# EAGLE design STELLA (EAGLE 9.6.2)

## Sheet 1 of 2
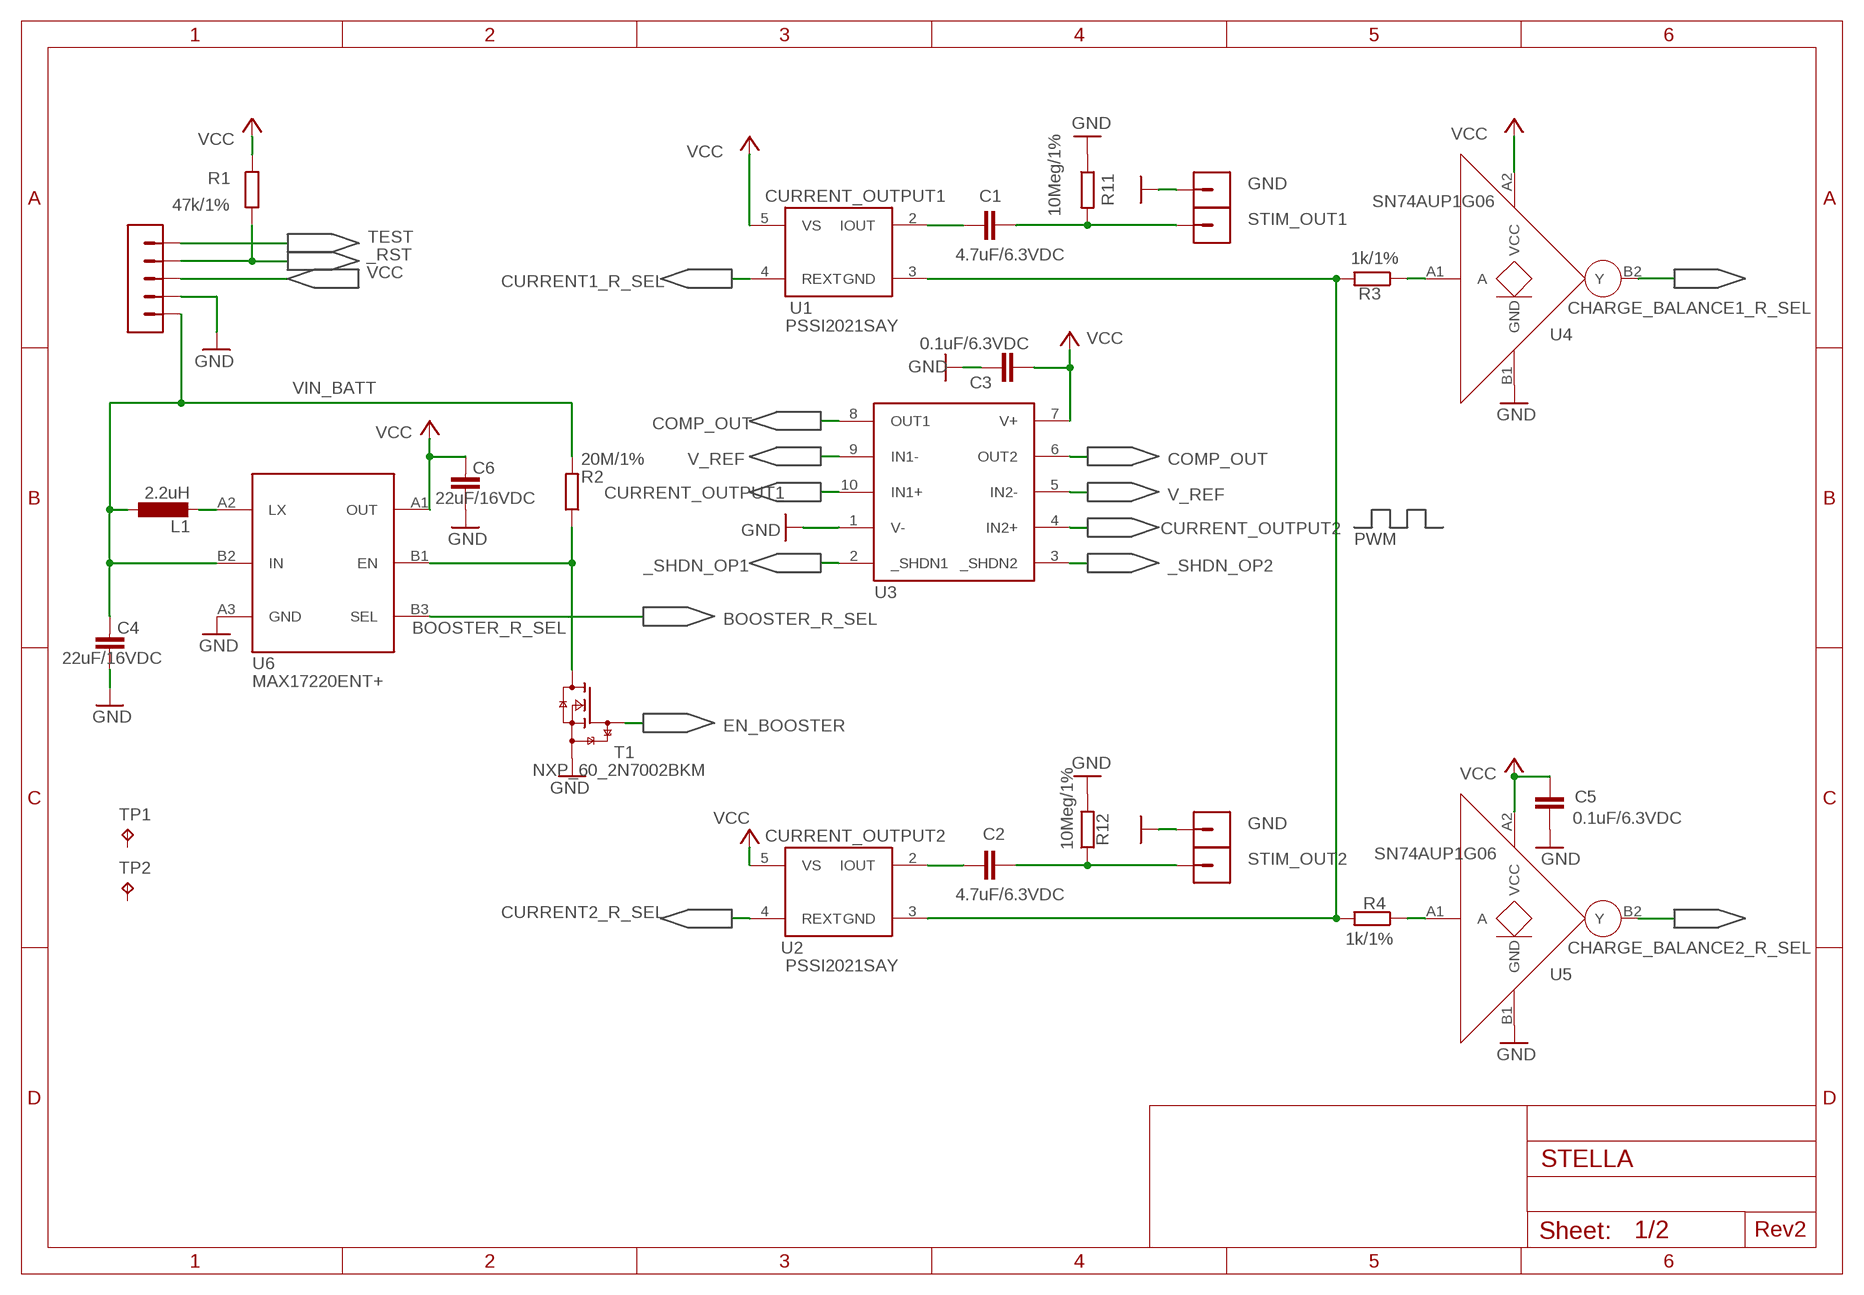
[diagram p0: schematic, sheet 1]

### Parts
C1  4.7uF/6.3VDC  C-EUC0402  [C0402]
C2  4.7uF/6.3VDC  C-EUC0402  [C0402]
C3  0.1uF/6.3VDC  C-EUC0402  [C0402]
C4  22uF/16VDC  MYRCL_C0603  [MYRCL_0603]
C5  0.1uF/6.3VDC  C-EUC0402  [C0402]
C6  22uF/16VDC  MYRCL_C0603  [MYRCL_0603]
L1  2.2uH  L-EU  [L0402]
R1  47k/1%  R-EU_R0402  [R0402]
R2  20M/1%  R-EU_R0402  [R0402]
R3  1k/1%  R-EU_R0402  [R0402]
R4  1k/1%  R-EU_R0402  [R0402]
R11  10Meg/1%  R-EU_R0402  [R0402]
R12  10Meg/1%  R-EU_R0402  [R0402]
T1  NXP_60_2N7002BKM  [NXP_60_SOT883(B)]
TP1  TPTP06SQ  [TP06SQ]
TP2  TPTP06SQ  [TP06SQ]
U1  PSSI2021SAY  [SOT353]
U2  PSSI2021SAY  [SOT353]
U3  TLV_9002S_TLV9002S_RUG  [TLV_9002S_TLV9002S_RUG]
U4  SN74AUP1G06  SN74AUP1G06_SN74AUP1G06  [SN74AUP1G06_SN74AUP1G06YFPR]
U5  SN74AUP1G06  SN74AUP1G06_SN74AUP1G06  [SN74AUP1G06_SN74AUP1G06YFPR]
U6  MAX17220ENT+  MAX17220  [MAX17220ENT]
X1  1PIN_INTERFACE  [1PIN_INTERFACE]
X2  1PIN_INTERFACE  [1PIN_INTERFACE]
X3  1PIN_INTERFACE  [1PIN_INTERFACE]
X4  1PIN_INTERFACE  [1PIN_INTERFACE]
X5  5PIN  [0.9MM/0.6MM]

### Nets
_RST: R1.2 X5.4 ; also sheet 2
_SHDN_OP1: U3.2(_SHDN1) ; also sheet 2
_SHDN_OP2: U3.3(_SHDN2) ; also sheet 2
BOOSTER_R_SEL: U6.B3(SEL) ; also sheet 2
CHARGE_BALANCE1_R_SEL: U4.B2(Y) ; also sheet 2
CHARGE_BALANCE2_R_SEL: U5.B2(Y) ; also sheet 2
COMP_OUT: U3.6(OUT2) U3.8(OUT1) ; also sheet 2
CURRENT1_R_SEL: U1.4(REXT) ; also sheet 2
CURRENT2_R_SEL: U2.4(REXT) ; also sheet 2
CURRENT_OUTPUT1: C1.2 U1.2(IOUT) U3.10(IN1+) ; also sheet 2
CURRENT_OUTPUT2: C2.2 U2.2(IOUT) U3.4(IN2+) ; also sheet 2
EN_BOOSTER: T1.1(G) ; also sheet 2
GND: C3.2 C4.2 C5.2 C6.2 R11.1 R12.2 T1.2(S) U3.1(V-) U4.B1(GND) U5.B1(GND) U6.A3(GND) X2.1 X4.1 X5.2 ; also sheet 2
N$1: R2.1 T1.3(D) U6.B1(EN)
N$5: L1.2 U6.A2(LX)
N$8: R3.1 U4.A1(A)
N$13: R4.1 U5.A1(A)
PWM: R3.2 R4.2 U1.3(GND) U2.3(GND) ; also sheet 2
STIM_OUT1: C1.1 R11.2 X1.1
STIM_OUT2: C2.1 R12.1 X3.1
TEST: X5.5 ; also sheet 2
V_REF: U3.5(IN2-) U3.9(IN1-) ; also sheet 2
VCC: C3.1 C5.1 C6.1 R1.1 U1.5(VS) U2.5(VS) U3.7(V+) U4.A2(VCC) U5.A2(VCC) U6.A1(OUT) X5.3 ; also sheet 2
VIN_BATT: C4.1 L1.1 R2.2 U6.B2(IN) X5.1 ; also sheet 2
Unconnected: TP1.TP TP2.TP

### Notes on the sheet
- U4
- U6
- U5
- Rev2

## Sheet 2 of 2
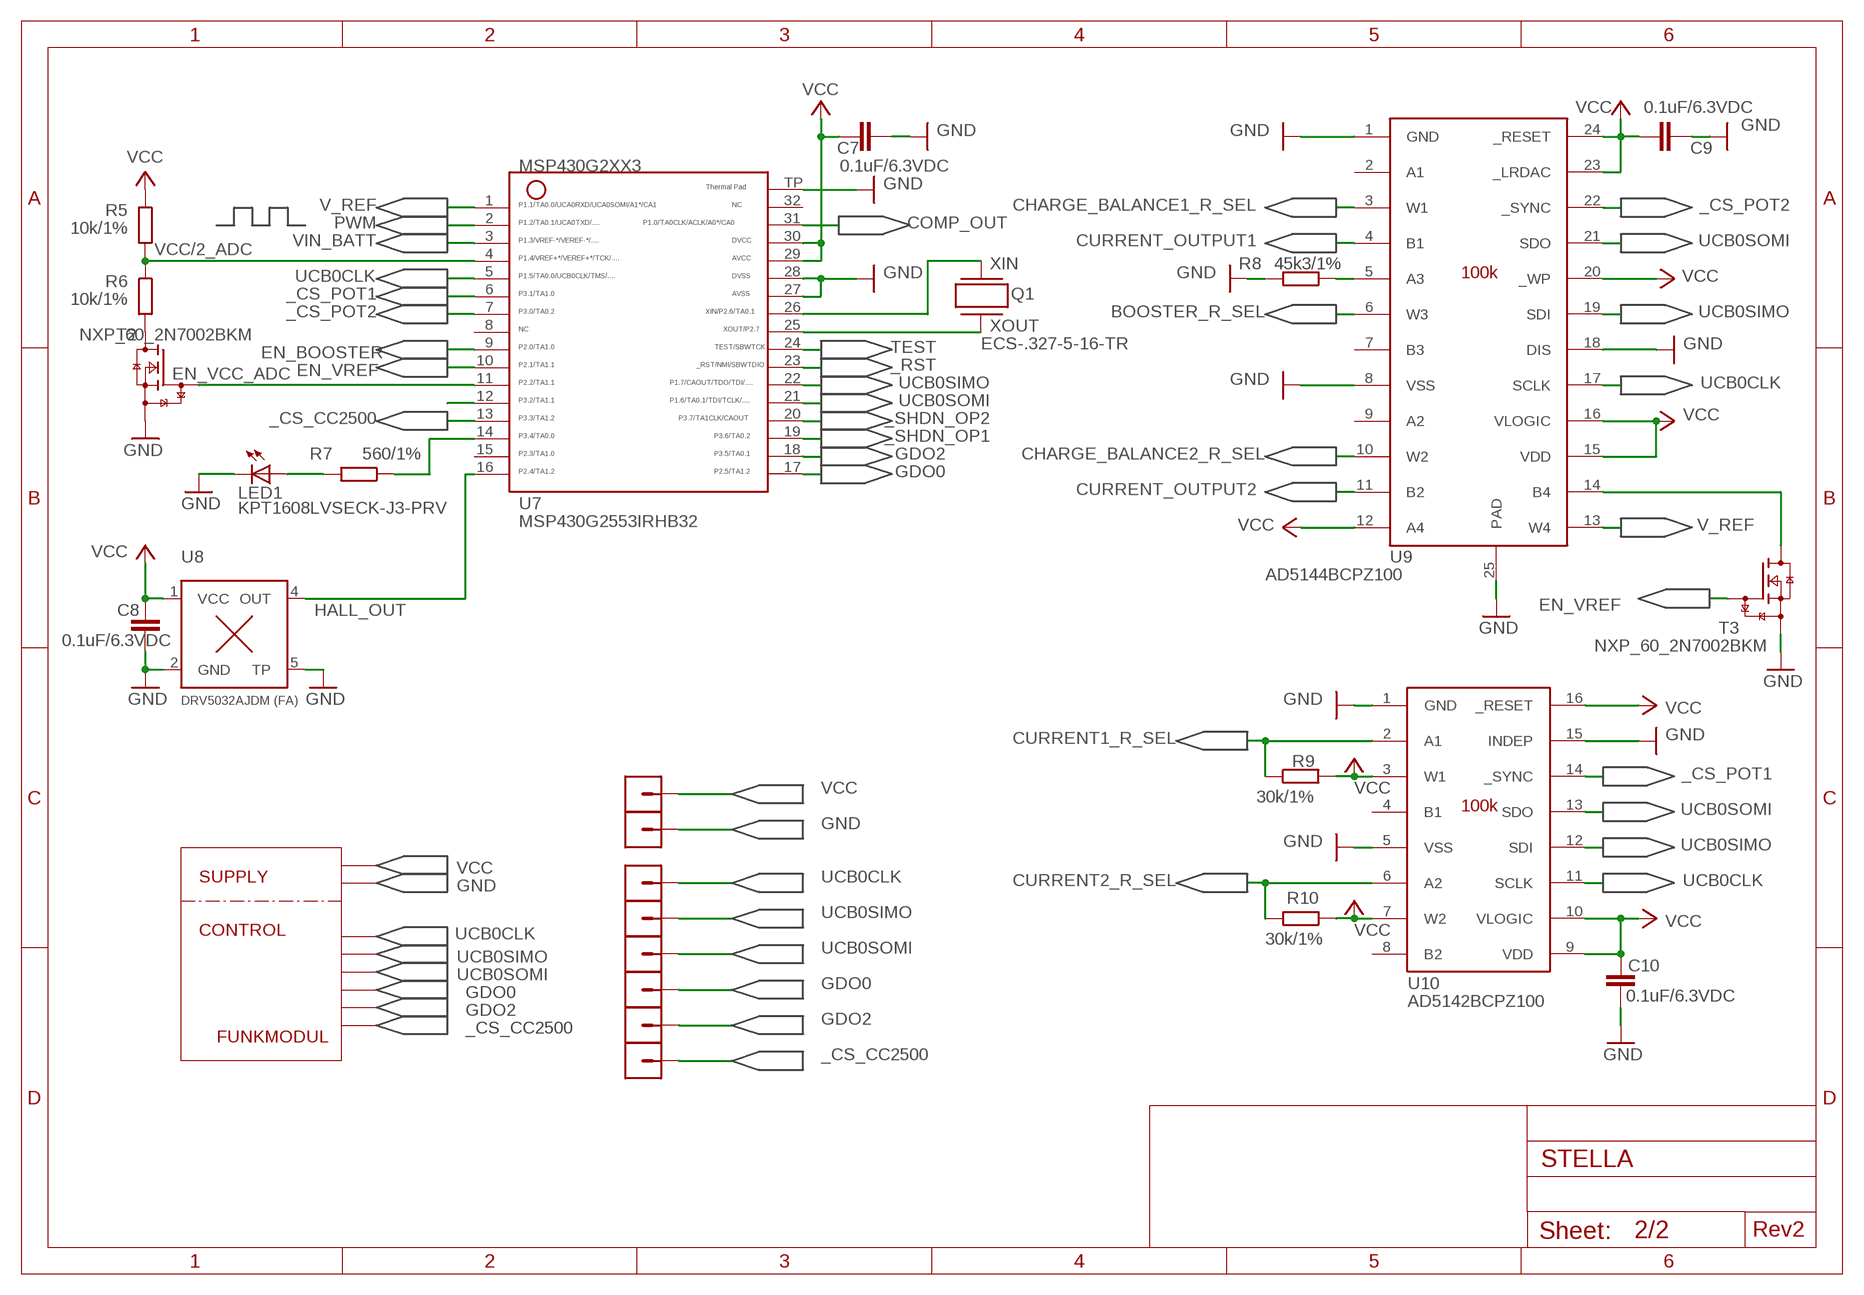
[diagram p1: schematic, sheet 2]

### Parts
C7  0.1uF/6.3VDC  C-EUC0402  [C0402]
C8  0.1uF/6.3VDC  C-EUC0402  [C0402]
C9  0.1uF/6.3VDC  C-EUC0402  [C0402]
C10  0.1uF/6.3VDC  C-EUC0402  [C0402]
LED1  KPT1608LVSECK-J3-PRV  LED_LEDCHIP-LED0603  [LED_CHIP-LED0603]
Q1  ECS-.327-5-16-TR  CRYSTAL_ECX_16_32768_ECX-16  [CRYSTAL_ECX_16_32768_ECX-16]
R5  10k/1%  R-EU_R0402  [R0402]
R6  10k/1%  R-EU_R0402  [R0402]
R7  560/1%  R-EU_R0402  [R0402]
R8  45k3/1%  R-EU_R0402  [R0402]
R9  30k/1%  R-EU_R0402  [R0402]
R10  30k/1%  R-EU_R0402  [R0402]
T2  NXP_60_2N7002BKM  [NXP_60_SOT883(B)]
T3  NXP_60_2N7002BKM  [NXP_60_SOT883(B)]
U7  MSP430G2553IRHB32  G2XX3---RHB32  [RHB32]
U8  DRV5032AJDM (FA)  DRV5032_DRV5032  [DRV5032_DRV5032_X2SON]
U9  AD5144BCPZ100  AD5144_AD5144  [AD5144_AD5144_LFCSP]
U10  AD5142BCPZ100  AD5122_AD5142  [AD5122_AD5142_LFCSP]
X6  1PIN_INTERFACE  [1PIN_INTERFACE]
X7  1PIN_INTERFACE  [1PIN_INTERFACE]
X8  1PIN_INTERFACE  [1PIN_INTERFACE]
X9  1PIN_INTERFACE  [1PIN_INTERFACE]
X10  1PIN_INTERFACE  [1PIN_INTERFACE]
X11  1PIN_INTERFACE  [1PIN_INTERFACE]
X12  1PIN_INTERFACE  [1PIN_INTERFACE]
X13  1PIN_INTERFACE  [1PIN_INTERFACE]

### Nets
_CS_CC2500: U7.13 X13.1
_CS_POT1: U7.6 U10.14(_SYNC)
_CS_POT2: U7.7 U9.22(_SYNC)
_CS_POT3: U7.12
_RST: U7.23 ; also sheet 1
_SHDN_OP1: U7.19 ; also sheet 1
_SHDN_OP2: U7.20 ; also sheet 1
BOOSTER_R_SEL: U9.6(W3) ; also sheet 1
CHARGE_BALANCE1_R_SEL: U9.3(W1) ; also sheet 1
CHARGE_BALANCE2_R_SEL: U9.10(W2) ; also sheet 1
COMP_OUT: U7.31 ; also sheet 1
CURRENT1_R_SEL: R9.1 U10.2(A1) ; also sheet 1
CURRENT2_R_SEL: R10.2 U10.6(A2) ; also sheet 1
CURRENT_OUTPUT1: U9.4(B1) ; also sheet 1
CURRENT_OUTPUT2: U9.11(B2) ; also sheet 1
EN_BOOSTER: U7.9 ; also sheet 1
EN_VCC_ADC: T2.1(G) U7.11
EN_VREF: T3.1(G) U7.10
GDO0: U7.17 X11.1
GDO2: U7.18 X12.1
GND: C7.2 C8.2 C9.1 C10.2 LED1.C R8.2 T2.2(S) T3.2(S) U7.27 U7.28 U7.TP U8.2(GND) U8.5(TP) U9.1(GND) U9.8(VSS) U9.18(DIS) U9.25(PAD) U10.1(GND) U10.5(VSS) U10.15(INDEP) X7.1 ; also sheet 1
HALL_OUT: U7.16 U8.4(OUT)
N$2: LED1.A R7.2
N$3: R6.2 T2.3(D)
N$4: R7.1 U7.14
N$9: R8.1 U9.5(A3)
N$10: T3.3(D) U9.14(B4)
PWM: U7.2 ; also sheet 1
TEST: U7.24 ; also sheet 1
UCB0CLK: U7.5 U9.17(SCLK) U10.11(SCLK) X8.1
UCB0SIMO: U7.22 U9.19(SDI) U10.12(SDI) X9.1
UCB0SOMI: U7.21 U9.21(SDO) U10.13(SDO) X10.1
V_REF: U7.1 U9.13(W4) ; also sheet 1
VCC: C7.1 C8.1 C9.2 C10.1 R5.1 R9.2 R10.1 U7.29 U7.30 U8.1(VCC) U9.12(A4) U9.15(VDD) U9.16(VLOGIC) U9.20(_WP) U9.23(_LRDAC) U9.24(_RESET) U10.3(W1) U10.7(W2) U10.9(VDD) U10.10(VLOGIC) U10.16(_RESET) X6.1 ; also sheet 1
VCC/2_ADC: R5.2 R6.1 U7.4
VIN_BATT: U7.3 ; also sheet 1
XIN: Q1.1 U7.26
XOUT: Q1.2 U7.25
Unconnected: U7.8 U7.15 U7.32 U9.2(A1) U9.7(B3) U9.9(A2) U10.4(B1) U10.8(B2)

### Notes on the sheet
- 100k
- Q1
- ECS-.327-5-16-TR
- MSP430G2553IRHB32
- 100k
- VCC
- SUPPLY
- GND
- CONTROL
- FUNKMODUL
- Rev2

## Library data of the parts
C1-C3 C5 C7-C10 = UKN_rcl:C-EU: CAPACITOR, European symbol
C4 C6 = UKN_STELLA4_0_1_021022:MYRCL_C0603
L1 = UKN_rcl:L-EU: INDUCTOR, European symbol
LED1 = eZ430-RF2500T_HW-V1.0_20070403:LED_LED: LED OSRAM: - CHIPLED LG R971, LG N971, LY N971, LG Q971, LY Q971, LO R971, LY R971 LH N974, LH R974 LS Q976, LO Q976, LY Q976 LO Q996 - Hyper CHIPLED LW Q18S LB Q993, LB Q99A, LB R99A - SideLED LS A670, LO A670, LY A670, LG A670, LP A670 LB A673, LV A673, LT A673, LW A673 LH A674 LY A675 LS A676, LA A676, LO A676, LY A676, LW A676 LS A679, LY A679, LG A679 - Hyper Micro SIDELED® LS Y876, LA Y876, LO Y876, LY Y876 LT Y87S - SmartLED LW L88C, LW L88S LB L89C, LB L89S, LG L890 LS L89K, LO L89K, LY L89K LS L896, LA L896, LO L896, LY L896 - TOPLED LS T670, LO T670, LY T670, LG T670, LP T670 LSG T670, LSP T670, LSY T670, LOP T670, LYG T670 LG T671, LOG T671, LSG T671 LB T673, LV T673, LT T673, LW T673 LH T674 LS T676, LA T676, LO T676, LY T676, LB T676, LH T676, LSB T676, LW T676 LB T67C, LV T67C, LT T67C, LS T67K, LO T67K, LY T67K, LW E67C LS E67B, LA E67B, LO E67B, LY E67B, LB E67C, LV E67C, LT E67C LW T67C LS T679, LY T679, LG T679 LS T770, LO T770, LY T770, LG T770, LP T770 LB T773, LV T773, LT T773, LW T773 LH T774 LS E675, LA E675, LY E675, LS T675 LS T776, LA T776, LO T776, LY T776, LB T776 LHGB T686 LT T68C, LB T68C - Hyper Mini TOPLED® LB M676 - Mini TOPLED Santana® LG M470 LS M47K, LO M47K, LY M47K Source: http://www.osram.convergy.de/
Q1 = stella2.1_bilateral_MainPCB:CRYSTAL_ECX_16_32768_ECX-16
R1-R12 = UKN_rcl:R-EU_: RESISTOR, European symbol
T1-T3 = stella2.1_bilateral_MainPCB:NXP_60_2N7002B: 60 V, single N-channel Trench MOSFET N-channel enhancement mode Field-Effect Transistor (FET) in a leadless ultra small DFN1006B-3 (SOT883B) Surface-Mounted Device (SMD) plastic package using Trench MOSFET technology. AAL Eindhoven MK
TP1 TP2 = testpad:TP: Test pad
U1 U2 = PSSI2021SAY:PSSI2021SAY: PSSI2021SAY Constant Current Source, SOT353 Package Manufacturer: NXP Author: Dipl.-Ing. FH Rainer Bayer, Hochschule Heilbronn HHN rainer.bayer@hs-heilbronn.de http://mitarbeiter.hs-heilbronn.de/~rbayer/
U3 = stella2.1_bilateral_MainPCB1:TLV_9002S_TLV9002S_RUG
U4 U5 = stella2.1_bilateral_MainPCB:SN74AUP1G06_SN74AUP1G06
U6 = MAX17220:MAX17220
U7 = TI_MSP430_v16:G2XX3---RHB32: MSP430G2XX1 QFN (RHB) 32 Pin Package
U8 = stella2.1_bilateral_MainPCB:DRV5032_DRV5032
U9 = stella2.1_bilateral_MainPCB:AD5144_AD5144
U10 = stella2.1_bilateral_MainPCB:AD5122_AD5142
X1-X4 X6-X13 = stella2.1_bilateral_MainPCB:1PIN_INTERFACE
X5 = MyVia:5PIN

## Net classes
0 default: width 0.1 mm
1 GND: width 0.4 mm
2 VCC: width 0.4 mm

## Board
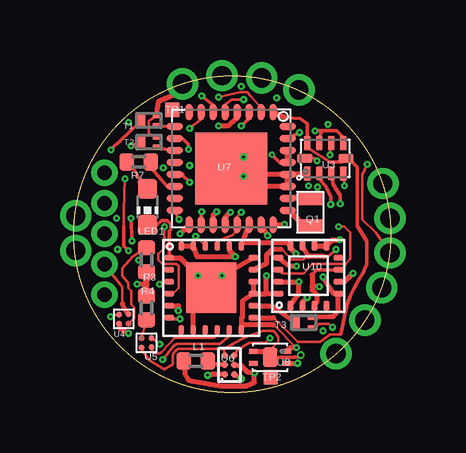
[diagram p2: board, top side]
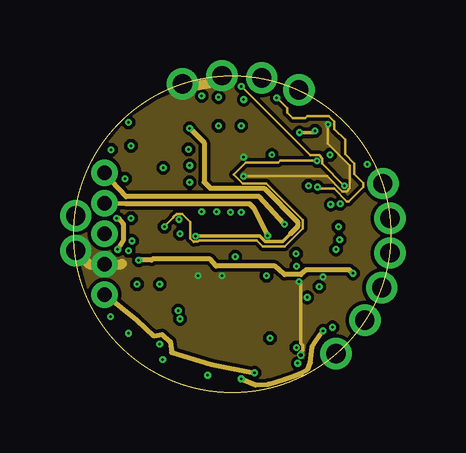
[diagram p3: board, inner layer Route2]
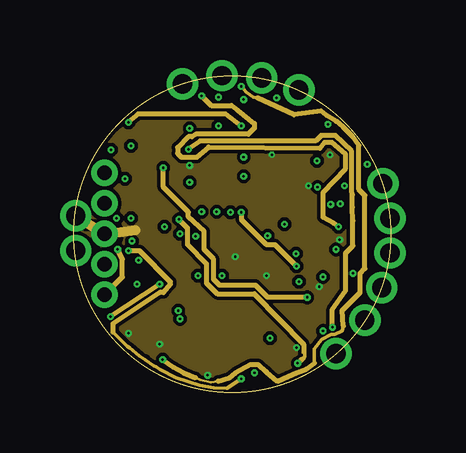
[diagram p4: board, inner layer Route3]
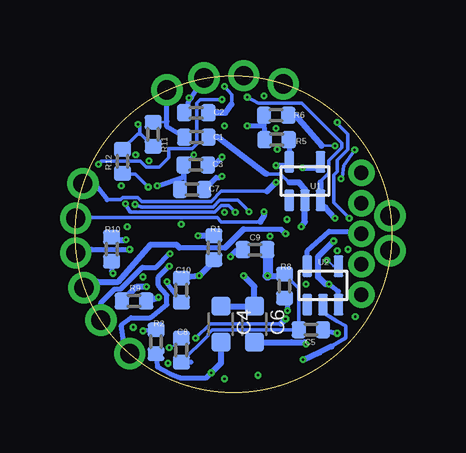
[diagram p5: board, bottom side, seen from below]

Size 13.2 x 13.2 mm. Coordinates in mm from the lower left corner, seen from the top.
Outline: circle at 6.6,6.6 radius 6.6
Copper layers ((1*2)+(3*16)): Top 0.035mm / dielectric 0.25mm / Route2 0.035mm / dielectric 0.25mm / Route3 0.035mm / dielectric 0.25mm / Bottom 0.035mm
Design rules "default *": minimum track width 3mil, minimum drill 3mil, track to track 2mil, track to pad 2mil, pad to pad 2mil, via to via 2mil, smd to smd 2mil, copper to edge 0mil, drill to drill 5mil, minimum pad ring 10mil, minimum via ring 3mil, stop-mask expansion 4mil, vias tented up to drill 0mil, thermal gap 10mil

### Footprints (pad centres in the part's own frame; a part is rotated, then mirrored left to right if it is on the bottom)
C0402 = smd 0.6 x 0.7: 1 -0.5,0; 2 0.5,0
MYRCL_0603 = smd 0.8 x 0.8: 1 0,0.75; 2 0,-0.75
L0402 = smd 0.6 x 0.7: 1 -0.5,0; 2 0.5,0
LED_CHIP-LED0603 = smd 0.8 x 0.8: A 0,-0.75; C 0,0.75
CRYSTAL_ECX_16_32768_ECX-16 = smd 0.5 x 1: 1 -0.55,0; 2 0.55,0
R0402 = smd 0.6 x 0.7: 1 -0.5,0; 2 0.5,0
NXP_60_SOT883(B) = smd 0.4 x 0.25: 1 -0.35,0.225; 2 -0.35,-0.225 | smd 0.4 x 0.7: 3 0.35,0
TP06SQ = smd 0.6 x 0.6: TP 0,0
SOT353 = smd 0.4 x 0.9: 1 -0.65,-0.8; 2 0,-0.8; 3 0.65,-0.8; 4 0.65,0.8; 5 -0.65,0.8
TLV_9002S_TLV9002S_RUG = smd 0.3 x 0.58: 1 -0.75,-0.635; 4 0.75,-0.635; 6 0.75,0.635; 9 -0.75,0.635 | smd 0.25 x 0.58: 2 -0.25,-0.635; 3 0.25,-0.635; 7 0.25,0.635; 8 -0.25,0.635 | smd 0.63 x 0.35: 5 0.86,0; 10 -0.86,0
SN74AUP1G06_SN74AUP1G06YFPR = smd 0.254 x 0.254: A1 -0.2,0.2; A2 0.2,0.2; B1 -0.2,-0.19; B2 0.2,-0.18
MAX17220ENT = smd 0.27 x 0.27: A1 -0.4,0.2; A2 0,0.2; A3 0.4,0.2; B1 -0.4,-0.2; B2 0,-0.2; B3 0.4,-0.2
RHB32 = smd 0.7 x 0.3: 1 -2.35,1.75; 2 -2.35,1.25; 3 -2.35,0.75; 4 -2.35,0.25; 5 -2.35,-0.25; 6 -2.35,-0.75; 7 -2.35,-1.25; 8 -2.35,-1.75; 17 2.35,-1.75; 18 2.35,-1.25; 19 2.35,-0.75; 20 2.35,-0.25; 21 2.35,0.25; 22 2.35,0.75; 23 2.35,1.25; 24 2.35,1.75 | smd 0.3 x 0.7: 9 -1.75,-2.35; 10 -1.25,-2.35; 11 -0.75,-2.35; 12 -0.25,-2.35; 13 0.25,-2.35; 14 0.75,-2.35; 15 1.25,-2.35; 16 1.75,-2.35; 25 1.75,2.35; 26 1.25,2.35; 27 0.75,2.35; 28 0.25,2.35; 29 -0.25,2.35; 30 -0.75,2.35; 31 -1.25,2.35; 32 -1.75,2.35 | smd 3 x 3: TP 0,0
DRV5032_DRV5032_X2SON = smd 0.22 x 0.4: 1 -0.25,0.7; 2 -0.25,-0.7; 3 0.25,-0.7; 4 0.25,0.7 | smd 0.8 x 0.6: 5 0,0
AD5144_AD5144_LFCSP = smd 0.4 x 0.25: 1 -1.75,1.25; 2 -1.75,0.75; 3 -1.75,0.25; 4 -1.75,-0.25; 5 -1.75,-0.75; 6 -1.75,-1.25; 13 1.75,-1.25; 14 1.75,-0.75; 15 1.75,-0.25; 16 1.75,0.25; 17 1.75,0.75; 18 1.75,1.25 | smd 0.25 x 0.4: 7 -1.25,-1.75; 8 -0.75,-1.75; 9 -0.25,-1.75; 10 0.25,-1.75; 11 0.75,-1.75; 12 1.25,-1.75; 19 1.25,1.75; 20 0.75,1.75; 21 0.25,1.75; 22 -0.25,1.75; 23 -0.75,1.75; 24 -1.25,1.75 | smd 2.1 x 2.1: 25 0,0
AD5122_AD5142_LFCSP = smd 0.4 x 0.23: 1 -1.25,0.75; 2 -1.25,0.25; 3 -1.25,-0.25; 4 -1.25,-0.75; 9 1.25,-0.75; 10 1.25,-0.25; 11 1.25,0.25; 12 1.25,0.75 | smd 0.23 x 0.4: 5 -0.75,-1.25; 6 -0.25,-1.25; 7 0.25,-1.25; 8 0.75,-1.25; 13 0.75,1.25; 14 0.25,1.25; 15 -0.25,1.25; 16 -0.75,1.25
1PIN_INTERFACE = drill 0.8 pad 1.1: 1 0,0
0.9MM/0.6MM = drill 0.6 pad 0.9: 1 0,0; 2 1.27,0; 3 2.54,0; 4 3.81,0; 5 5.08,0

### Placement (x,y rotation side)
C1  8.14,10.66 0 bottom
C2  8.15,11.68 0 bottom
C3  8.18,9.5 0 bottom
C4  7.12,2.85 180 bottom
C5  3.38,2.62 180 bottom
C6  5.72,2.85 180 bottom
C7  8.32,8.47 0 bottom
C8  8.78,1.78 270 bottom
C9  5.71,5.96 180 bottom
C10  8.78,4.28 270 bottom
L1  5.08,1.33 0 top
LED1  3.06,7.75 180 top
Q1  9.85,7.53 270 top
R1  7.42,6.05 90 bottom
R2  9.82,2.12 270 bottom
R3  3.02,5.54 270 top
R4  3.02,3.54 90 top
R5  4.79,10.55 180 bottom
R6  4.83,11.57 0 bottom
R7  2.7,9.62 180 top
R8  4.47,4.45 90 bottom
R9  10.75,3.83 180 bottom
R10  11.68,5.99 270 bottom
R11  9.95,10.78 90 bottom
R12  11.22,9.65 90 bottom
T1  3.12,11.35 180 top
T2  3.12,10.45 180 top
T3  9.57,2.92 180 top
TP1  4.1,11.8 0 top
TP2  8.2,0.65 0 top
U1  3.62,8.82 0 bottom
U2  2.88,4.47 0 bottom
U3  10.47,9.78 0 top
U4  2.08,3.08 180 top
U5  3.02,2.08 0 top
U6  6.49,1.16 90 top
U7  6.55,9.36 270 top
U8  8.18,1.47 270 top
U9  5.72,4.38 0 top
U10  9.78,4.88 90 top
X1  9.38,12.62 0 top
X2  6.17,13.22 0 top
X3  7.83,13.12 0 top
X4  4.53,12.88 0 top
X5  1.28,4.08 90 top
X6  0.08,7.38 0 top
X7  0.08,5.92 0 top
X8  13.18,5.83 0 top
X9  12.12,3.02 0 top
X10  10.93,1.62 0 top
X11  12.82,4.38 0 top
X12  13.18,7.28 0 top
X13  12.88,8.72 0 top

### Tracks (layer width: path | path; a pad name or v marks a point on that pad's centre or on a via)
_CS_CC2500  (via drill 0.1 pad 0.28)
  Top 0.15: 4.5,9.11 v4.83,8.78
  Top 0.2: U7.13 4.5,9.11
  Bottom 0.15: 5.2,8.4 7.1,8.4 7.53,7.97 10.42,7.97 10.59,8.14 11.21,8.14 11.3,8.05 11.87,8.05
  Bottom 0.2: X13.1 12.38,8.72 11.87,8.05
  Bottom 0.254: 5.2,8.4 v4.83,8.78
_CS_POT1  (via drill 0.1 pad 0.28)
  Top 0.1: v11.03,6.92 11.28,6.92 11.53,6.67 11.53,5.58 11.32,5.38 9.93,5.38 9.57,4.97 8.68,4.97 U10.14
  Top 0.15: U7.6 5.8,12 v5.33,12.38
  Route3 0.2: v5.33,12.38 5.72,11.97 6.58,11.97 6.83,11.78 7.53,11.22 7.53,11.03 7.28,10.78 5.08,10.78 4.92,10.68 4.78,10.68 4.33,10.22 4.33,9.97 4.47,9.82 5.12,9.82 5.61,10.25 10.26,10.2 10.45,10.45 10.75,10.45 11.3,9.97 11.3,9.32 10.38,8.35 10.38,7.33 10.82,7.08 v11.03,6.92
_CS_POT2  (via drill 0.1 pad 0.28)
  Top 0.1: U9.22 v5.08,6.53 | U7.7 5.3,11.41 v4.83,11.03
  Route2 0.15: v5.08,6.53 7.74,6.53 7.97,6.3 8.7,6.3 9.03,6.62
  Route2 0.2: v4.83,11.03 5.42,10.43 5.42,8.78 5.67,8.53 7.92,8.53 9.32,7.12 9.32,6.92 9.03,6.62
_RST  (via drill 0.1 pad 0.28)
  Top 0.2: v8.07,6.55 7.8,6.99 U7.23
  Route2 0.2: v8.07,6.55 7.5,7.7 7.33,7.88 2.17,7.88 X5.4
  Bottom 0.254: v8.07,6.55 v8.07,6.56 8,6.55 R1.2
_SHDN_OP1  (via drill 0.1 pad 0.28)
  Top 0.15: v10.7,7.85 10.7,8.18 10.5,8.62 10.22,8.9 U3.2
  Top 0.2: U7.19 5.8,7.41 v5.95,7.55
  Bottom 0.15: v5.95,7.55 6.42,8.03 7.17,8.03 7.45,7.75 10.45,7.75 v10.7,7.85
_SHDN_OP2  (via drill 0.1 pad 0.28)
  Top 0.15: v11.1,7.88 11.1,8.22 10.8,8.68 U3.3
  Top 0.2: U7.20 6.3,7.3 v6.53,7.53
  Bottom 0.15: v6.53,7.53 6.8,7.8 7.1,7.8 7.38,7.53 10.9,7.53 v11.1,7.88
BOOSTER_R_SEL  (via drill 0.1 pad 0.28)
  Top 0.1: U6.B3 6.8,1.75 6.95,1.85 7.12,1.97 7.3,2.08 7.97,2.08 v8.18,2.28
  Top 0.15: U9.6 4.08,3.12 4.12,3.08 v4.42,3.08
  Bottom 0.15: 4.62,2.88 7.58,2.88 v8.18,2.28
  Bottom 0.254: v4.42,3.08 4.62,2.88
CHARGE_BALANCE1_R_SEL  (via drill 0.1 pad 0.28)
  Top 0.1: U9.3 v3.58,4.53 | U4.B2 v1.53,3.17
  Route3 0.2: v1.53,3.17 v3.58,4.53
CHARGE_BALANCE2_R_SEL
  Top 0.1: U9.10 5.97,2.53 arc-90 5.72,2.28 4.2,2.28 3.65,1.67 arc-115 U5.B2
COMP_OUT  (via drill 0.1 pad 0.28 layers 1-2)
  Top 0.15: U3.6 11.22,10.65 10.97,10.9 10.93,10.93 10.32,10.93 | 10.32,10.93 10.22,10.62 U3.8 | U7.31 v9.4,10.85 | v10.05,10.93 10.32,10.93
  Route2 0.15: v9.4,10.85 9.97,10.85 v10.05,10.93
CURRENT1_R_SEL  (via drill 0.1 pad 0.28)
  Top 0.2: U10.2 9.53,3.77 v9.72,3.98
  Route3 0.2: v9.72,3.98 8.07,3.98 7.58,4.47 6.08,4.47 5.83,4.72 5.83,5.58 5.42,5.97 5.42,6.72 4.78,7.33 4.78,7.53 3.73,8.57 v3.73,9.38
  Bottom 0.1: U1.4 2.98,9.38
  Bottom 0.2: R9.1 10.18,3.83
  Bottom 0.254: 10.18,3.83 v9.72,3.98 | 2.98,9.38 v3.73,9.38
CURRENT2_R_SEL  (via drill 0.1 pad 0.28)
  Top 0.2: v11.62,4.97 11.28,4.62 U10.6
  Route2 0.2: v11.62,4.97 11.47,5.12 9.68,5.12 9.46,4.92 8.78,4.92 8.38,5.28 5.92,5.28 5.67,5.58 3.27,5.58 3.24,5.53 v2.7,5.53
  Bottom 0.1: U2.4 2.45,5.28 v2.7,5.53
  Bottom 0.2: R10.2 11.68,5.06 v11.62,4.97
CURRENT_OUTPUT1  (via drill 0.1 pad 0.28)
  Top 0.1: U9.4 4.12,4.12 4.38,4.38 4.38,5.28 4.28,5.38 3.67,5.38 3.52,5.53 3.52,5.78 3.77,6.03 v3.77,6.92 | U3.10 10.03,9.78 v10.12,9.68
  Route2 0.1: v10.12,9.68 8.6,9.68 8.52,9.6 7.17,9.6 6.67,9.1 7.04,8.73 8.01,8.73 9.53,7.21 9.53,6.84 8.78,6.1 7.88,6.1 7.63,6.35 5.22,6.35 5.17,6.3 5.02,6.3 5,6.28 4.85,6.43 4.85,7.13 4.52,7.45 4.28,7.45 4.15,7.32 4.15,7.3 v3.77,6.92
  Bottom 0.1: U1.2 3.62,7.72
  Bottom 0.15: 5.22,9.12 4.67,9.12 4.28,8.78 | 3.62,8.47 U1.2
  Bottom 0.254: C1.2 7.62,10.71 7.28,10.68 5.22,9.12 | 4.28,8.78 3.88,8.78 3.62,8.47 | v3.77,6.92 3.62,7.12 3.62,7.72
CURRENT_OUTPUT2  (via drill 0.1 pad 0.28)
  Top 0.1: U9.11 6.47,2.35 6.08,2.03 4.3,2.03 arc55 4.15,1.92 v3.7,1.38 | U3.4 11.28,9.09 v11.28,8.62
  Route2 0.1: v11.28,8.62 10.35,9.55 10.35,9.77 10.22,9.9 9.85,9.9 v6.97,12.78
  Route3 0.1: 5.08,0.62 5.28,0.53 5.7,0.42 6,0.47
  Route3 0.15: 10.03,1.22 10.03,1.83 10.32,2.22 10.72,2.42 10.88,2.42 11.18,2.58 11.22,2.77 | 7.66,12.29 7.47,12.32 7.17,12.53 v6.97,12.78
  Route3 0.2: v3.7,1.38 4.12,1.08 4.58,0.83 5.08,0.62 | 6,0.47 6.47,0.62 6.72,0.83 7.38,1.17 7.67,1.17 8.03,0.88 8.47,0.47 8.93,0.67 9.28,0.83 9.68,0.97 10.03,1.22 | 11.22,2.77 11.18,3.42 11.93,4.17 11.93,4.97 12.12,5.17 12.12,8.22 11.88,8.47 11.88,10.32 11.62,10.68 11.22,11.07 10.93,11.32 10.53,11.57 10.3,11.75 9.17,11.6 7.66,12.29
  Bottom 0.1: U2.2 2.98,3.67 2.77,3.27
  Bottom 0.15: 2.77,3.27 2.28,2.98 1.92,2.77 1.92,2.28 2.53,1.92 | 6.67,12.03 6.67,12.43 v6.97,12.78
  Bottom 0.254: 2.53,1.92 3.02,1.67 v3.7,1.38 | C2.2 6.92,11.68 6.67,12.03
EN_BOOSTER
  Top 0.15: T1.1 U7.9
EN_VCC_ADC
  Top 0.15: T2.1 4.03,10.12 4.08,10.18 U7.11
EN_VREF  (via drill 0.1 pad 0.28)
  Top 0.1: T3.1 10.05,2.7 10.22,2.88 10.62,2.88 v10.78,2.73
  Top 0.15: U7.10 4.54,10.61 4.78,10.38 v4.78,10.15
  Route3 0.2: v10.78,2.73 10.78,3.48 11.32,4.25 11.32,5.83 11.62,6.12 11.62,7.17 11.6,7.72 11.6,8.25 11.57,8.43 11.57,10.07 10.9,10.72 10.3,10.72 10.07,10.5 5.26,10.5 v4.78,10.15
GDO0  (via drill 0.1 pad 0.28)
  Top 0.2: v4.42,6.62 U7.17
  Bottom 0.2: X11.1 12.62,4.38 12.32,4.58 | 8.85,6.05 6.95,6.05 | 6.17,6.83 4.62,6.83 v4.42,6.62
  Bottom 0.254: 12.32,4.58 12.28,4.62 11.41,4.62 10.05,6.17 8.97,6.17 8.85,6.05 | 6.95,6.05 6.17,6.83
GDO2  (via drill 0.1 pad 0.28)
  Top 0.15: U7.18 5.3,7.5
  Top 0.2: 5.3,7.5 v5.33,7.55
  Bottom 0.15: X12.1 13.15,7.3 7.28,7.3 7.1,7.12 5.47,7.12
  Bottom 0.254: 5.47,7.12 5.33,7.38 v5.33,7.55
GND  (via drill 0.1 pad 0.28, 0.15 pad 0.28 layers 1-2)
  Top 0.1: 6.62,2.01 6.62,2.03 | 6.62,2.03 6.28,1.83 | 6.28,1.83 4.38,1.83 arc83 4.12,1.47 | U6.A3 6.28,1.8 6.28,1.83 | 4.12,1.47 arc7 4.12,1.42 | T2.2 3.12,10.78 3.12,11.32 T1.2 | 6.62,2.03 7.17,2.33 7.6,2.47 7.88,2.58 8.32,2.58 8.53,2.33 8.53,2.12 8.22,1.83 8.22,1.53 U8.5 | 4.12,1.47 4.12,1.42 | 4.12,1.42 4.12,1.17 3.77,0.97 3.17,1.33 3.02,1.53 2.92,1.66 2.83,1.79 U5.B1 | 2.03,3.71 2.03,4.4 X5.2
  Top 0.15: U9.1 3.98,6.75 4.04,6.82 4.04,7.04 3.88,7.19 3.67,7.19 3.48,7 LED1.C 3.04,7 2.98,7.08 | U8.5 9.2,1.47 9.21,1.49 9.37,1.49 v9.45,1.57
  Top 0.2: 8.9,9.12 U7.28 7.92,9.11 v7.08,9.82 | U7.27 7.62,8.61 v7.08,9.03 6.75,9.36 U7.TP | U9.1 4.42,5.62 v5.17,4.88 | U9.18 v6.17,4.88 | U10.15 v9.38,4.62 9.38,4.12 9.18,3.88 U10.1 | U9.8 4.97,3.55 5.17,3.75 5.58,3.73 U9.25 | v10.38,4.83 10.82,4.12 U10.5 11.03,3.42 10.82,3.17 10.62,3.17 T3.2 | U4.B1 2.03,3.71 | T1.2 3.48,11.87 3.52,12.15 4.53,12.58 X4.1 | U8.2 7.92,1.72 U8.5
  Top 0.25: U7.27 U7.28 | U9.25 5.72,4.42 v6.17,4.88
  Top 0.254: U3.1 9.62,9.14 9.57,9.1 U7.28
  Route2 0.1: v10.58,11.2 10.58,10.39 11.5,9.47 11.5,8.53 11.37,8.4 11.18,8.4 10.55,9.03 v7.08,9.03 | 1.27,5.34 X5.2
  Route2 0.15: v9.38,4.62 9.45,4.55 9.45,2.06 9.53,1.98 9.53,1.77 9.45,1.69 v9.45,1.57
  Route2 0.406: X7.1 0.64,5.36 X5.2 | X5.2 1.36,5.33 1.97,5.35 | X5.2 1.97,5.36 2,5.38 | X4.1 4.72,12.75 5.97,12.97 X2.1
  Bottom 0.1: C5.2 3.88,2.77 | 10.58,10.79 10.55,10.77 10.51,10.79
  Bottom 0.15: 10.58,10.79 R12.2 | R11.1 10.47,10.79 10.51,10.79 10.51,11.12 v10.58,11.2 | R8.2 3.88,4.35 C5.2 4.52,2.62 4.73,2.62 4.73,2.63 7.48,2.63 7.65,2.46 7.65,2.4 C8.2
  Bottom 0.2: C3.2 7.4,9.5 v7.08,9.82 | C10.2 9.38,4.58 v9.38,4.62 | C8.2 8.38,1.28 | C7.2 7.33,8.97 7.17,8.97 v7.08,9.03
  Bottom 0.25: C4.2 C6.2 5.72,4.42 v6.17,4.88 | v5.17,4.88 4.54,4.88 R8.2
  Bottom 0.406: v5.17,4.88 5.17,5.96 C9.1
  pour Route2 (isolate 0.15, no thermals): 0.28,7.22 0.12,6.22 0.33,5.38 0.6,4.38 1.03,3.52 1.72,2.53 2.5,1.7 3.67,0.92 4.83,0.45 5.83,0.22 7.38,0.22 8.78,0.55 10,1.12 11.12,2 11.93,3.12 12.57,4.28 12.97,5.75 13.03,7.53 12.68,8.78 12.15,9.93 11.1,11.2 9.9,12.15 8.6,12.68 7.55,13 5.83,12.95 4.65,12.68 3.5,12.18 2.25,11.38 1.25,10.15 0.62,8.95 0.38,8.03
HALL_OUT  (via drill 0.1 pad 0.28)
  Top 0.1: U7.16 4.28,7.42 v4.38,7.22
  Top 0.2: U8.4 v9.32,1.22
  Route3 0.2: v4.38,7.22 4.72,6.88 4.72,6.17 5.53,5.38 5.53,4.58 5.97,4.12 7.52,4.12 9.57,2.02 9.57,1.47 v9.32,1.22
N$1  (via drill 0.1 pad 0.28)
  Top 0.1: v2.12,8.93 2.08,7.58 2.08,6.92
  Top 0.15: T1.3 2.67,11.22 1.59,10.18 v1.55,10.12 | 2.08,6.92 2.08,6.12 v2.28,5.92
  Top 0.2: U6.B1 v6.97,0.58
  Route2 0.2: v6.97,0.58 7.58,0.33 8.1,0.35 8.78,0.55 9.15,0.67 9.5,0.83 9.75,0.97 9.85,1.25 9.93,1.92 10.07,2.15 v10.38,2.58
  Route3 0.1: 4.03,4.62 4.03,4.53
  Route3 0.15: 1.62,2.53 2.22,1.92 2.33,1.88 2.73,1.53 2.98,1.38 3.33,1.12 3.42,1.08 3.58,0.97 4.28,0.62 5.25,0.3 5.83,0.2 6.38,0.17 v6.97,0.58
  Route3 0.2: v2.28,5.92 2.73,5.92 4.03,4.62 | 4.03,4.53 3.73,4.17 3.58,4.17 1.62,2.88 1.62,2.53
  Bottom 0.15: v1.55,10.12 2,9.48 2.08,8.97 v2.12,8.93
  Bottom 0.2: R2.1 v10.38,2.58
N$2
  Top 0.1: 2.33,9.6 2.65,9.1 2.83,8.7
  Top 0.254: R7.2 2.33,9.6 | 2.83,8.7 LED1.A
N$3  (via drill 0.1 pad 0.28)
  Top 0.2: T2.3 2.62,10.3 v2.38,10.3
  Bottom 0.1: 2.92,10.3 v2.38,10.3
  Bottom 0.254: R6.2 4.03,11.57 2.92,10.3
N$4
  Top 0.15: U7.14 3.9,8.61 3.23,9.38 R7.1
N$5
  Top 0.2: U6.A2 5.38,1.17 L1.2
N$8
  Top 0.1: U4.A1 2.53,3.12 2.53,3.55 2.4,3.67 2.4,4.25 2.28,4.38 2.28,4.58 2.03,4.88 2.03,5.17 2.44,5.68 2.99,6.04 R3.1
N$9  (via drill 0.1 pad 0.28)
  Top 0.2: U9.5 4.35,3.62 v4.35,3.42
  Bottom 0.2: R8.1 4.5,3.94 4.35,3.68 v4.35,3.42
N$10
  Top 0.2: U9.14 8.25,3.62 8.3,3.58 8.72,3.27 T3.3
N$13
  Top 0.1: U5.A1 R4.1
PWM  (via drill 0.1 pad 0.28)
  Top 0.1: U7.2 7.72,11.97 7.38,12.38 7.22,12.53 6.92,12.53 v6.03,12.32
  Top 0.15: v2.38,7.28 v2.42,6.33
  Top 0.2: v2.62,4.53 3.02,4.53
  Top 0.254: R4.2 3.02,4.53 R3.2
  Bottom 0.15: v6.03,12.32 5.58,12.07 3.75,12.07 2.42,10.75 2.08,10.41 2.08,10.21 2.63,9.67 2.63,9.16 2.98,8.81 2.98,8.78 | U1.3 2.92,7.97 2.77,7.72
  Bottom 0.2: U2.3 2.22,4.22 v2.62,4.53
  Bottom 0.254: 2.98,8.78 U1.3 | v2.62,4.53 2.77,4.53 3.08,4.83 3.08,5.67 v2.42,6.33 | 2.77,7.72 v2.38,7.28
STIM_OUT1
  Bottom 0.1: R11.2 9.43,11.28 9.38,11.32
  Bottom 0.2: C1.1 9.38,11.09 9.38,11.32 X1.1
STIM_OUT2  (via drill 0.1 pad 0.28)
  Route2 0.1: v8.45,12.3 8.89,11.86 8.89,11.68 9.11,11.45 9.64,11.45 9.72,11.53 10.62,11.53 10.85,11.3 10.85,11 11.3,10.55 11.3,9.94 11.68,9.57 11.68,9.11 12.05,8.74 12.05,8.59 11.45,7.98 11.38,7.98 10.85,8.51 10.21,8.51 v10.15,8.57
  Bottom 0.1: 11.22,9.11 R12.1
  Bottom 0.15: 7.83,13.1 X3.1 | v10.15,8.57 10.69,9.11 11.22,9.11 | v8.45,12.3 8.36,12.3
  Bottom 0.2: C2.1 8.47,11.68 8.47,12.12 8.36,12.3 7.83,13.1
TEST  (via drill 0.1 pad 0.28)
  Top 0.2: U7.24 v8.78,7.03
  Route2 0.2: v8.78,7.03 7.72,8.18 2.17,8.18 X5.5
UCB0CLK  (via drill 0.1 pad 0.28)
  Top 0.1: 9.72,5.67 9.55,5.55 9.05,5.55 8.68,5.97 | U7.5 6.33,12.03 6.58,12.22 v7.08,12.22 | v12.22,9.53 12.03,9.07 12.03,7.22 12.57,6.67 X8.1
  Top 0.125: v10.93,5.97 10.57,5.67 | 9.78,5.67 9.72,5.67 | 8.68,5.97 8.62,5.97
  Top 0.15: 10.57,5.67 10.43,5.67
  Top 0.2: 10.43,5.67 9.78,5.67 9.62,5.92 U10.11 | 8.62,5.97 8.28,5.97 8.03,5.72 8.03,5.38 U9.17
  Bottom 0.15: v7.08,12.22 7.97,12.22 8.12,12.07 8.12,10.38 8.32,10.18 9.3,10.18 9.3,9.8 9.69,9.41 10.23,9.41 10.48,9.65 12.1,9.65 v12.22,9.53
  Bottom 0.2: X8.1 12.53,5.97 v10.93,5.97
UCB0SIMO  (via drill 0.1 pad 0.28)
  Top 0.2: U7.22 U9.19 7.02,6.25 8.92,6.25 U10.12 9.03,6.03 v9.25,5.8
  Bottom 0.2: X9.1 12.12,3.75 11.55,4.33 11.3,4.33 10.4,5.22 9.82,5.22 v9.25,5.8
UCB0SOMI  (via drill 0.1 pad 0.28)
  Top 0.1: U9.21 5.97,6.22 6.1,6.38 6.62,6.58 6.8,6.75 U7.21 6.8,7.36 v6.97,7.53
  Top 0.2: U10.13 8.97,5.28 v9.28,5.28
  Route3 0.2: v6.97,7.53 6.97,7.22 8.03,6.17 8.38,6.17 v9.28,5.28
  Bottom 0.2: X10.1 11.18,2.12 11.28,2.83 10.88,3.12 10.07,3.12 9.38,3.67 9.38,4.08 9.72,4.47 9.72,4.83 v9.28,5.28
V_REF
  Top 0.1: 11.12,2.42 10.68,2.42 10.28,2.12 9.32,2.12 8.32,3.12 | 10.68,9.62 9.72,10.22 U3.9
  Top 0.15: 8.82,11.47 9.43,11.43 9.72,11.22 U3.9 | 11.12,2.42 11.38,3.62 11.53,4.03 11.68,4.38 11.9,4.75 12.03,4.92 12.2,5.35 12.2,6.33 11.8,6.95 11.8,9.4 11.43,9.78 U3.5 11.18,9.62 10.68,9.62
  Top 0.2: U7.1 8.82,11.47 | U9.13 8.32,3.12
VCC  (via drill 0.1, 0.1 pad 0.28)
  Top 0.1: v9.28,1.88 8.32,2.83 | U5.A2 v3.58,2.03 | U3.7 10.68,10.36 v10.68,9.93
  Top 0.15: U10.7 10.12,5.12 9.93,4.92 | U7.29 8.57,9.61 v8.25,9.93
  Top 0.2: U9.16 U9.15 | U9.15 8.03,4.12 | U9.15 7.03,3.83 7.03,3.12 6.97,3.12 U9.12 6.97,2.73 7.08,2.83 8.32,2.83 | 9.93,4.92 9.93,4.42 | 9.93,4.42 9.93,4.28 10.12,4.08 10.12,3.77 U10.3 | v9.28,1.88 9.03,1.88 U8.1 | U4.A2 1.92,2.67 v2.28,2.47 | U6.A1 5.75,0.75 v5.58,0.72 | U10.10 U10.9 10.78,6.38 v11.07,6.38 | U10.16 8.03,4.12 | 8.03,4.12 v8.03,4.88 | U9.24 U9.23 5.12,5.67 v6.72,5.67 6.47,5.92 U9.20 | v10.22,4.42 9.93,4.42
  Top 0.254: U7.30 U7.29 8.97,9.61 8.93,9.78 8.9,9.93 U7.30
  Route3 0.406: X6.1 X5.3 2.58,6.78
  Bottom 0.1: C8.1 9.21,1.84 v9.28,1.88 | C3.1 8.61,9.43 8.61,8.7
  Bottom 0.15: 4.28,9.47 U1.5 | C3.1 v8.25,9.93
  Bottom 0.2: v9.78,8.62 8.68,8.98 C3.1 | R10.1 11.43,6.38 | R5.1 4.28,10.53 U1.5 | C5.1 v2.28,2.47 | U2.5 3.52,5.92 2.62,6.72 1.42,6.72 X5.3 | C7.1 8.61,8.7 | v6.72,5.67 6.43,5.96 C9.2 | R9.2 11.22,3.83
  Bottom 0.25: C6.1 4.18,2.1 3.65,2.1 v3.58,2.03
  Bottom 0.254: 11.43,6.38 v11.07,6.38 | R1.1 7.45,5.45 v8.03,4.88 C10.1 | 11.22,3.83 10.62,4.42 v10.22,4.42 | v4.83,9.47 4.28,9.47
  pour Route3 (isolate 0.15): 0.2,5.75 0.17,7.35 0.55,8.82 1.15,10.03 1.8,10.85 2.5,11.5 3.2,12.07 4.4,12.68 5.65,13.03 6.67,13.1 7.55,13 8.38,12.82 9.07,12.57 9.82,12.25 10.47,11.8 11,11.38 11.55,10.82 11.93,10.3 12.35,9.62 12.75,8.65 13.07,7.33 13.07,6.67 13.03,5.83 12.82,4.88 12.5,3.92 11.9,2.92 11.47,2.35 10.88,1.75 9.95,1.1 9.1,0.7 8.1,0.35 7.2,0.2 6.55,0.15 5.88,0.2 4.97,0.33 4.17,0.65 3.55,0.92 3,1.28 2.47,1.67 1.95,2.17 1.4,2.83 0.97,3.42 0.62,4.17 0.33,5.08
VCC/2_ADC  (via drill 0.1 pad 0.28)
  Top 0.2: U7.4 6.78,11.68 6.78,11.43 6.42,11.12 v6.03,11.12
  Bottom 0.2: R5.2 R6.1 5.42,11.12 v6.03,11.12
VIN_BATT  (via drill 0.1 pad 0.28)
  Top 0.15: U7.3 7.3,11.46 v6.97,11.12
  Top 0.2: L1.1 4.62,0.78 4.78,0.53 4.9,0.49 6.12,0.28 7.19,0.28 7.53,0.42 v7.53,0.83 7.22,0.88 6.97,1.12 U6.B2
  Route2 0.1: 1.88,7.28 v1.78,7.28 | X5.1 1.32,4.08 1.33,4.08
  Route2 0.2: 1.33,4.08 2.62,3.02 3.33,2.38 3.67,2.42 4.03,2.12 4.08,1.67 5.72,1.17 v7.53,0.83 | v1.83,5.97 2.08,6.38 2.08,7.03 1.88,7.28
  Route3 0.2: X5.1 2.03,4.83 2.03,5.58 v1.83,5.97 | v6.97,11.12 6.33,11.62 2.67,11.62 v2.28,11.28
  Bottom 0.15: v1.78,7.28 2.42,7.92 2.42,9.07 2.28,9.22 2.28,9.7 1.83,10.14 1.83,10.79 2.28,11.23 v2.28,11.28
  Bottom 0.2: R2.2 9.78,1.08 9.22,0.78 8.82,0.62 7.72,0.62 v7.53,0.83
  Bottom 0.25: C4.1 7.12,1.22 v7.53,0.83
XIN
  Top 0.254: Q1.1 9.78,8.18 9.57,8.12 8.93,8.12 U7.26
XOUT
  Top 0.254: U7.25 9,7.61 9.47,7.08 Q1.2

### Text on the board
tValues: DRV5032AJDM
Reference: GND | STIM_OUT2 | GND | STIM_OUT1 | Steg | TEST | _CS_CC2500 | VCC | RST | GDO2 | GND | VCC | UCB0CLK | GND | GDO0 | VBAT | UCB0SIMO | Steg | UCB0SOMI
Beschreib: 9 | 10 | 11 | 12 | 14/01/2020 ukn/DO | 13 | 3 | 1 | 14 | 4 | 2 | 15 | 5 | 16 | 6 | 17 | 7 | 8 | 1 bis 8: Aussenverbindung zur Funkplatine (nur optional) | 9,10: schwarz 10cm Teflon | 11,12: weiss, 10 cm Teflon | 17: rot, 10 cm Teflon | 13 bis 16: Programmieradapter 1,27 mm